# Altium project Power_Regulation_Unit.PrjPcb
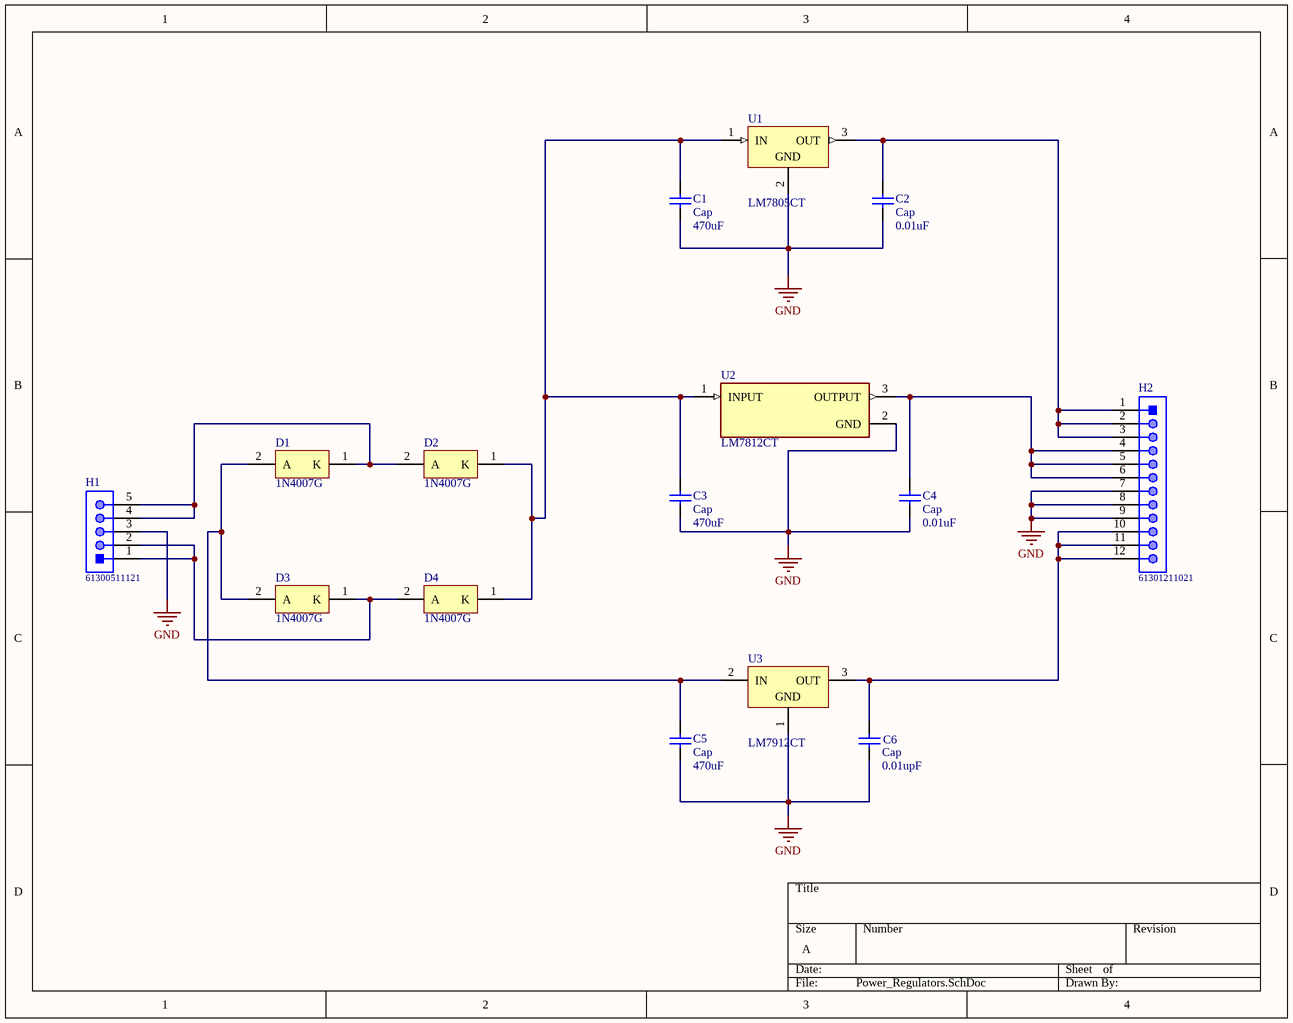
[diagram p0: Power_Regulators.SchDoc]
1 sheet, 15 parts. Net scope: global (net labels, ports and power ports of the same name join across sheets).
Board file: Power_Regulators.PcbDoc

## Sheet Power_Regulators.SchDoc
size A; SheetNumber: 1; SheetTotal: 1

### Parts
C1  Cap  value 470uF  [RAD-0.3]
C2  Cap  value 0.01uF  [RAD-0.3]
C3  Cap  value 470uF  [RAD-0.3]
C4  Cap  value 0.01uF  [RAD-0.3]
C5  Cap  value 470uF  [RAD-0.3]
C6  Cap  value 0.01upF  [RAD-0.3]
D1  1N4007G  [ONSC-AXIAL_LEAD-2-59-10_P]
D2  1N4007G  [ONSC-AXIAL_LEAD-2-59-10_P]
D3  1N4007G  [ONSC-AXIAL_LEAD-2-59-10_P]
D4  1N4007G  [ONSC-AXIAL_LEAD-2-59-10_P]
H1  61300511121  [61300511121]
H2  61301211021  [61301211021]
U1  LM7805CT  [FAIR-TO-220-3]
U2  LM7812CT  [FP-TO220B03-MFG]
U3  LM7912CT  [NDE0003A]

### Nets
GND: C1.1 C2.1 C3.1 C4.1 C5.1 C6.1 H1.3 H2.7 H2.8 H2.9 U1.2(GND) U2.2(GND) U3.1(GND)
NetC1_2: C1.2 C3.2 D2.1(K) D4.1(K) U1.1(IN) U2.1(INPUT)
NetC2_2: C2.2 H2.1 H2.2 H2.3 U1.3(OUT)
NetC4_2: C4.2 H2.4 H2.5 H2.6 U2.3(OUTPUT)
NetC5_2: C5.2 D1.2(A) D3.2(A) U3.2(IN)
NetC6_2: C6.2 H2.10 H2.11 H2.12 U3.3(OUT)
NetD1_1: D1.1(K) D2.2(A) H1.4 H1.5
NetD3_1: D3.1(K) D4.2(A) H1.1 H1.2

### Library data of the parts
C1-C6 = Cap: Capacitor; Published: 8-Jun-2000; LatestRevisionDate: 17-Jul-2002; LatestRevisionNote: Re-released for DXP Platform.; PackageReference: RAD-0.3; Publisher: Altium Limited; PackageDescription: Radial Cap, Thru-Hole; 2 Leads; 0.3 in Pin Spacing
D1-D4 = CMP-0902-00143-1: Standard Recovery Rectifier, 2-Pin Axial_Lead, Pb-Free, Bulk Bag; Manufacturer: On Semiconductor; VRRM Max (V): 1000; IFSM Max (A): 30; IO(rec) Max (A): 1; ComponentLink2Description: Datasheet; ComponentLink2URL: http://www.onsemi.com/pub_link/Collateral/1N4001-D.PDF; PackageDescription: 2-Pin, Axial Lead, Diameter 2.35 mm; PartNumber: 1N4007G; ComponentLink1URL: http://www.onsemi.com/; ComponentLink3URL: http://www.onsemi.cn/pub_link/Collateral/59-10.PDF; PackageReference: AXIAL_LEAD-2-59-10; ComponentLink1Description: Manufacturer URL; Mounting Technology: Through Hole; ComponentLink3Description: Package Specification; Packing: Bulk Bag; PackageVersion: Rev. U, 02/2005; DatasheetVersion: Rev. 13; RoHS: TRUE; Type: Standard Recovery
H1 = CMP-1502-01068-1: THT Vertical Pin Header WR-PHD, Pitch 2.54 mm, Single Row, 5 pins; Manufacturer: Wurth Elektronik; Pin Number: 5; Contact Resistance: 20mOhm; Working Voltage: 250VAC; Pitch: 2.54mm; Withstanding Voltage: 500VAC; Rated Current: 3A; Gender: Male; Datasheet URL: https://katalog.we-online.de/em/datasheet/6130xx11121.pdf; Orientation: Vertical; Mounting Technology: THT; Row Number: Single; Package Reference: 61300511121; Publisher: WurthElektronik; Part Number: 61300511121; Packaging: Bag; Manufacturer URL: http://www.we-online.de; Operating Temperature: -40to105degC
H2 = CMP-1502-01085-1: THT Angled Pin Header WR-PHD, Pitch 2.54 mm, Single Row, 12 pins; Manufacturer: Wurth Elektronik; Gender: Male; Withstanding Voltage: 500VAC; Working Voltage: 250VAC; Pitch: 2.54mm; Pin Number: 12; Rated Current: 3A; Contact Resistance: 20mOhm; Package Reference: 61301211021; Manufacturer URL: http://www.we-online.de; Orientation: Angled; Datasheet URL: https://katalog.we-online.de/em/datasheet/6130xx11021.pdf; Packaging: Bag; Operating Temperature: -40to105degC; Part Number: 61301211021; Publisher: WurthElektronik; Row Number: Single; Mounting Technology: THT
U1 = CMP-2000-04938-1: Positive Voltage Regulator, 5 V, 1 A, -40 to 125 degC, 3-Pin TO-220, RoHS, Tube; Manufacturer: FairchildSemiconductor; Maximum Input Voltage: 35V; Maximum Quiescent Current: 8mA; Load Regulation: 100mV; Maximum Output Current: 2.2(Typ)A; Output Type: Fixed; Typical Dropout Voltage @ Current: 2@1AV; Rad Hard: No; Output Voltage: 5V; Accuracy: ±4%; Number of Outputs: 1; Category: LinearRegulator; Package Description: 3-Pin Through Hole Device, Body 10 x 4.5 mm, Pitch 2.54 mm; Packaging: Rail/Tube; Mounting: ThroughHole; Polarity: Positive; Manufacturer URL: https://www.fairchildsemi.com/; Line Regulation: 100mV; Datasheet Version: Aug-12; Datasheet URL: https://datasheet.ciiva.com/26904/lm7805ct-26904988.pdf; Package Reference: TO-220; Package URL: https://www.fairchildsemi.com/package-drawings/TO/TO220B03.pdf; Package: 3TO-220AB; Operating Temperature: -40to125degC; Type: Linear
U2 = CMP-07128-000015-1: IC REG LINEAR 12V 1A TO220-3; Obsolete Part: true; Manufacturer: ON Semiconductor; Nominal Supply Current: 5.1mA; Output Type: Fixed; Dropout Voltage: 2V; Max Supply Voltage: 35V; Accuracy Percentage: 4%; Standoff Height: 2.7mm; Number Of Outputs: 1; Octopart: https://octopart.com/lm7812ct-on+semiconductor-14383031; Output Current: 1A; ComponentLink2Description: Datasheet; Device Class L1: Integrated Circuits (ICs); Device Class L2: Power Management ICs; Temperature Range Low: -40°C; Category: IC; Package: TO220B03; Device Class L3: Voltage Regulators - Linear; RoHS: TRUE; Digikey Description: IC REG LINEAR 12V 1A TO220-3; Ipc Land Pattern Name: TO-220; Output Voltage: 12V; Temperature: -40°C to +125°C; Automotive: No; Temperature Range High: +125°C; ComponentLink2URL: https://www.mouser.in/datasheet/2/308/LM7812-1125088.pdf; Manufacturer Part Number: LM7812CT; Height: 20.4mm; Lead Free: Yes
U3 = CMP-0062-02472-3: 3-Terminal Negative Regulator, 3-pin TO-220; Manufacturer: Texas Instruments; CompType: LDO IC; PowerWise: N; PackageTopMarking: NSUZXYTTE#*LM7912CT; PinCount: 3; RoHS: N; PackageDescription: TO-220, Molded, 3 Lead, Straight; ComponentLink1URL: http://www.ti.com/general/docs/lit/getliterature.tsp?genericPartNumber=LM7912&fileType=pdf; PackageReference: NDE0003A; ComponentLink1Description: Datasheet URL